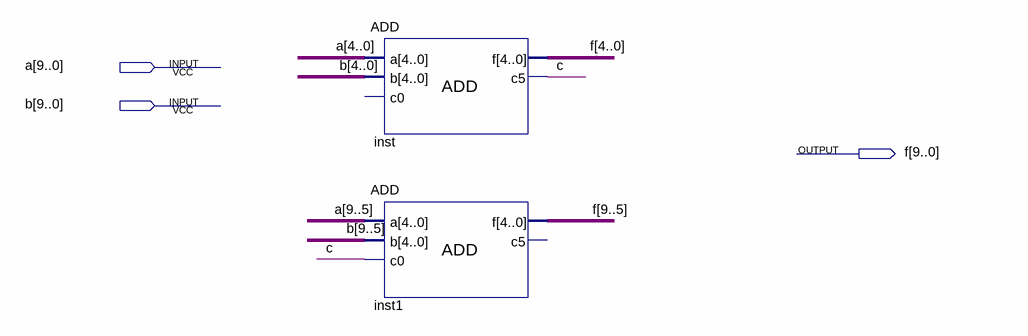
[diagram p0: schematic sheet]
// Quartus schematic ADD10.bdf as structural Verilog: 2 symbols, 3 pins
module ADD10 (
  input  [9:0] a,
  input  [9:0] b,
  output [9:0] f
);

  wire c;

  ADD inst (.a(a[4:0]), .b(b[4:0]), .f(f[4:0]), .c5(c));  // open: c0
  ADD inst1 (.a(a[9:5]), .b(b[9:5]), .c0(c), .f(f[9:5]));  // open: c5
endmodule
